# EAGLE schematic untitled (EAGLE 6.1)
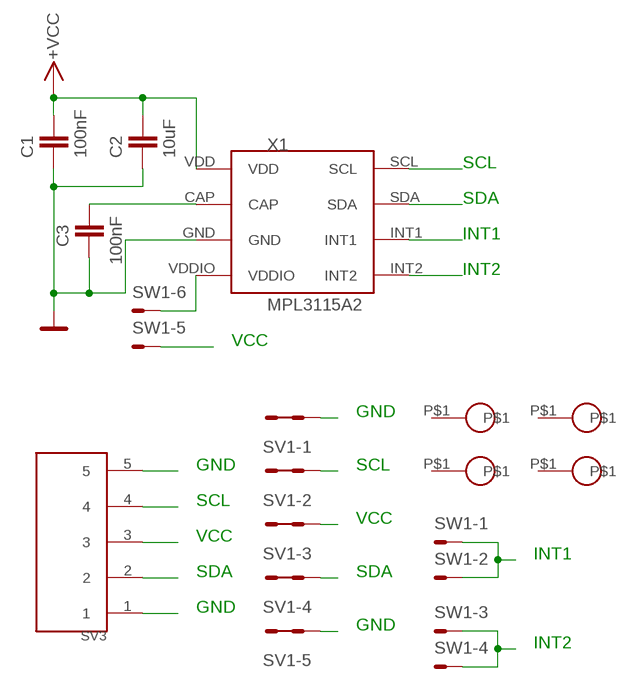
[diagram p0: schematic, sheet 1]

## Parts
C1  100nF  C-EUC0805  [C0805]
C2  10uF  C-EUC0805  [C0805]
C3  100nF  C-EUC0805  [C0805]
SV1  MA05-2  [MA05-2]
SV3  SMD_MA05-01  [SMD_MA05-1]
SW1  MA03-3  [MA03-2]
X1  MPL3115A2  [LGA]
X2  SROUB3M  [SROUB3M]
X3  SROUB3M  [SROUB3M]
X4  SROUB3M  [SROUB3M]
X5  SROUB3M  [SROUB3M]

## Nets
GND: C1.2 C2.2 C3.2 SV1.1 SV1.2 SV1.9 SV1.10 SV3.1 SV3.5 X1.GND
INT1: SW1.1 SW1.2 X1.INT1
INT2: SW1.3 SW1.4 X1.INT2
N$1: SW1.6 X1.VDDIO
N$3: C3.1 X1.CAP
SCL: SV1.3 SV1.4 SV3.4 X1.SCL
SDA: SV1.7 SV1.8 SV3.2 X1.SDA
VCC: C1.1 C2.1 SV1.5 SV1.6 SV3.3 SW1.5 X1.VDD ; supply symbol labelled +VCC
Unconnected: X2.P$1 X3.P$1 X4.P$1 X5.P$1

## Notes on the sheet
- SCL
- SDA
- INT1
- INT2
- VCC
- GND
- GND | SCL
- SCL
- VCC
- VCC
- INT1
- SDA | SDA
- GND
- GND
- INT2

## Library data of the parts
C1-C3 = rcl:C-EU: CAPACITOR, European symbol
SV1 = moje_hrebinky:MA05-2: PIN HEADER; OC_FARNELL: unknown; OC_NEWARK: unknown
SV3 = moje_hrebinky:SMD_MA05-01
SW1 = moje_hrebinky:MA03-3
X1 = moje_cidla:MPL3115A2: DIGITALNI CIDLO TLAKU A TEPLOTY MPL3115A2
X2-X5 = moje:SROUB3M